# EAGLE design Thruster-Commander-Programmer (EAGLE 8.4.3)
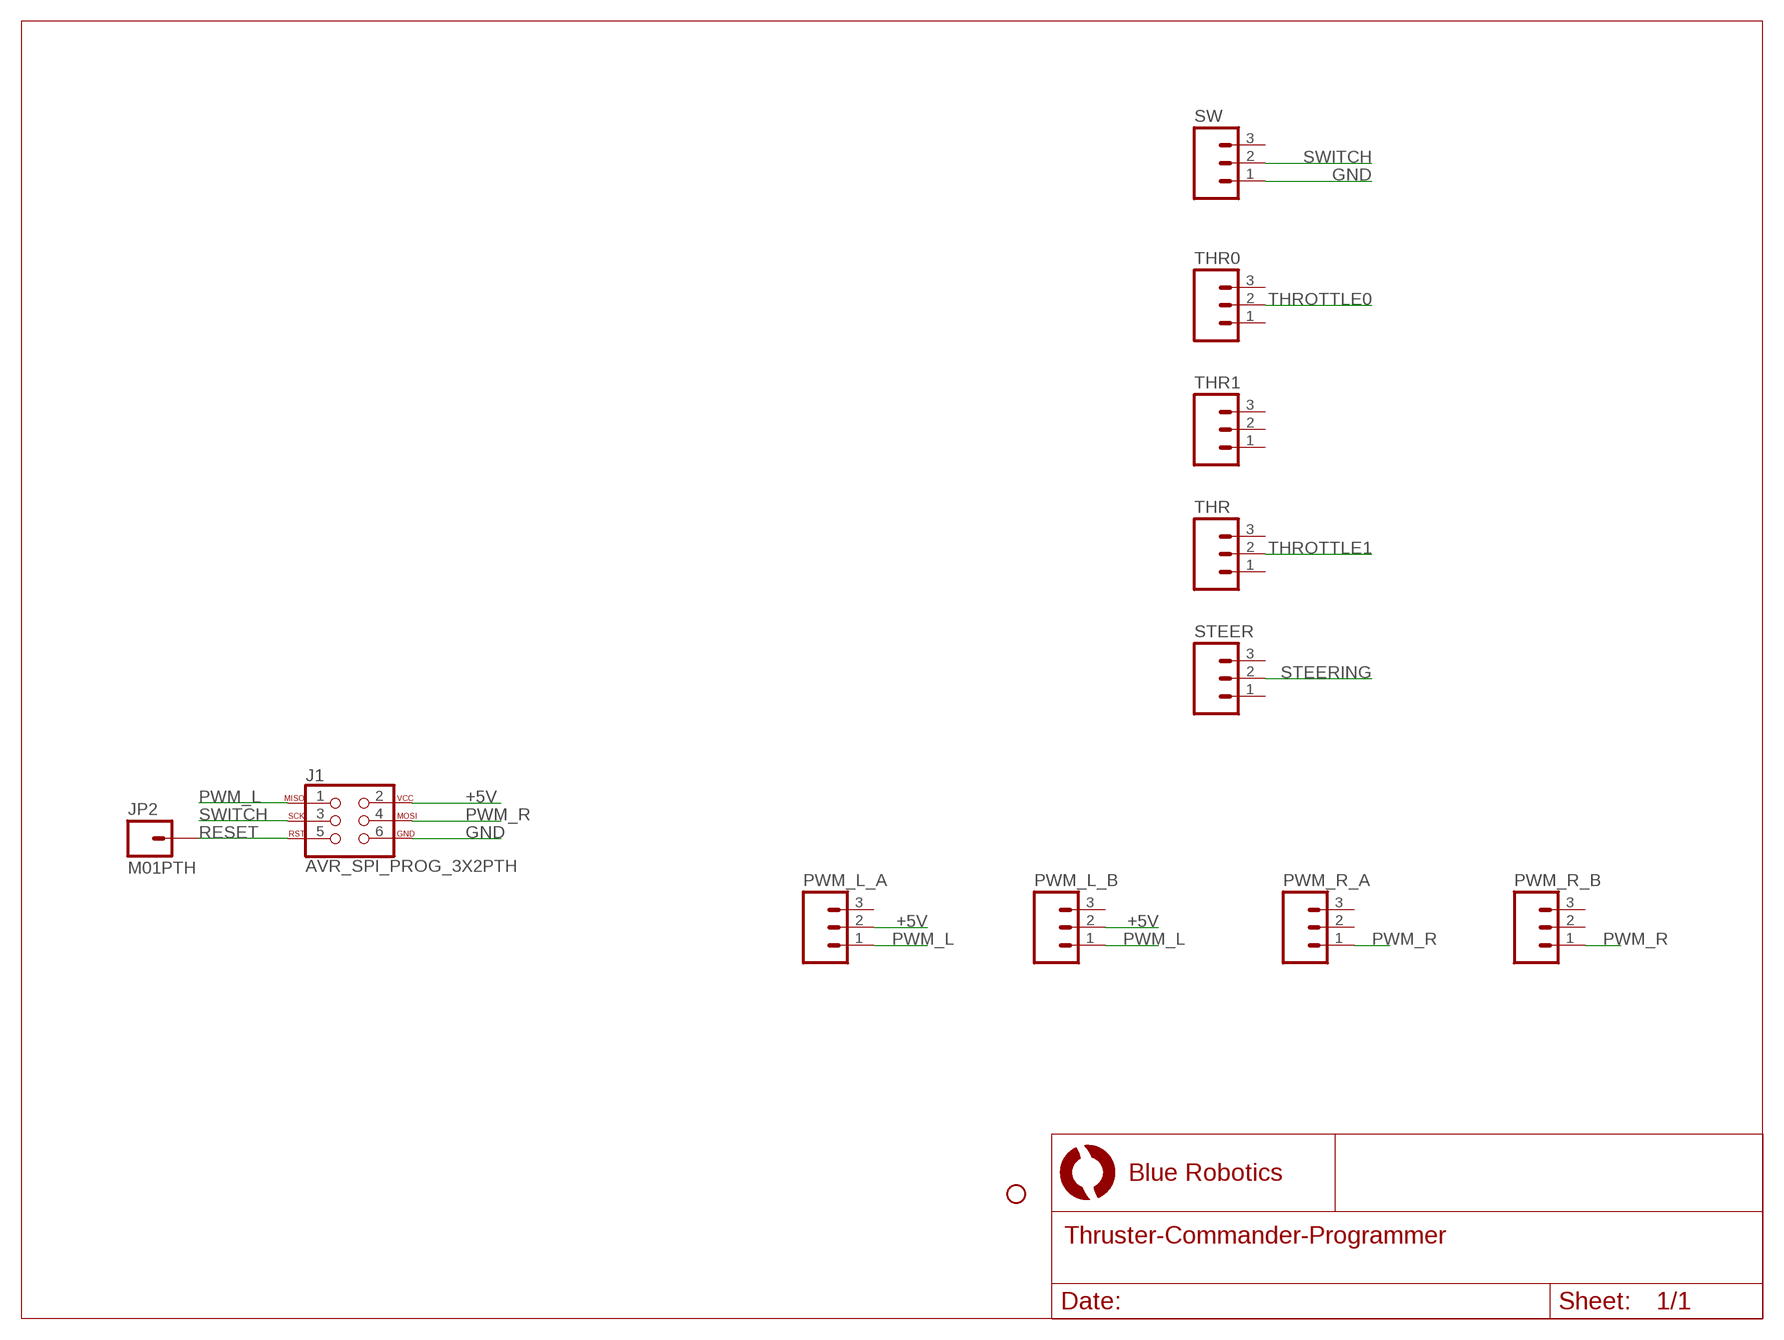
[diagram p0: schematic, sheet 1]

## Parts
J1  AVR_SPI_PROG_3X2PTH  [2X3]
JP2  M01PTH  [1X01]
PWM_L_A  M03PTH  [1X03]
PWM_L_B  M03PTH  [1X03]
PWM_R_A  M03PTH  [1X03]
PWM_R_B  M03PTH  [1X03]
STANDOFF1  STAND-OFF  [STAND-OFF]
STEER  M03PTH  [1X03]
SW  M03PTH  [1X03]
THR  M03PTH  [1X03]
THR0  M03PTH  [1X03]
THR1  M03PTH  [1X03]

## Nets
+5V: J1.2 PWM_L_A.2 PWM_L_B.2
GND: J1.6 SW.1
PWM_L: J1.1 PWM_L_A.1 PWM_L_B.1
PWM_R: J1.4 PWM_R_A.1 PWM_R_B.1
RESET: J1.5 JP2.1
STEERING: STEER.2
SWITCH: J1.3 SW.2
THROTTLE0: THR0.2
THROTTLE1: THR.2
Unconnected: PWM_L_A.3 PWM_L_B.3 PWM_R_A.2 PWM_R_A.3 PWM_R_B.2 PWM_R_B.3 STEER.1 STEER.3 SW.3 THR0.1 THR0.3 THR1.1 THR1.2 THR1.3 THR.1 THR.3

## Library data of the parts
J1 = SparkFun-Connectors:AVR_SPI_PROG_3X2: AVR ISP 6 Pin This is the reduced ISP connector for AVR programming. Common on Arduino. This footprint will take up less PCB space and can be used with a 10-pin to 6-pin adapter such as SKU: BOB-08508 **Special note about "TEST_POINT" package. The stop mask is on the top side, so if you want your programming test points to be on the bottom of your board, make sure to place this package on the bottom side of the board. This also ensure that the orientation to program from the bottom side will be correct. SparkFun Products: SparkFun ISP Pogo Adapter <https://www.sparkfun.com/products/11591> - NS Tiny AVR Programmer <https://www.sparkfun.com/products/11801> -PTH
JP2 = SparkFun-Connectors:M01: Header 1 Standard 1-pin 0.1" header. Use with straight break away headers (SKU : PRT-00116), right angle break away headers (PRT-00553), swiss pins (PRT-00743), machine pins (PRT-00117), and female headers (PRT-00115).
PWM_L_A PWM_L_B PWM_R_A PWM_R_B STEER SW THR THR0 THR1 = SparkFun-Connectors:M03: Header 3 Standard 3-pin 0.1" header. Use with straight break away headers (SKU : PRT-00116), right angle break away headers (PRT-00553), swiss pins (PRT-00743), machine pins (PRT-00117), and female headers (PRT-00115). Molex polarized connector foot print use with SKU : PRT-08232 with associated crimp pins and housings.
STANDOFF1 = SparkFun-Electromechanical:STAND-OFF: #4 Stand Off This is the mechanical footprint for a #4 phillips button head screw. Use the keepout ring to avoid running the screw head into surrounding components. SKU : PRT-00447

## Board
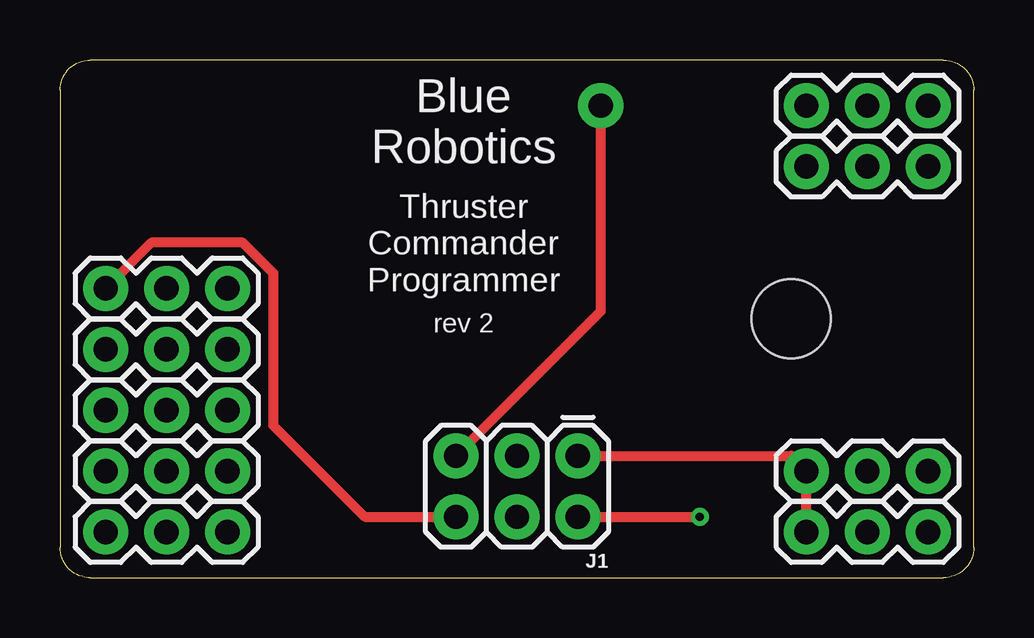
[diagram p1: board, top side]
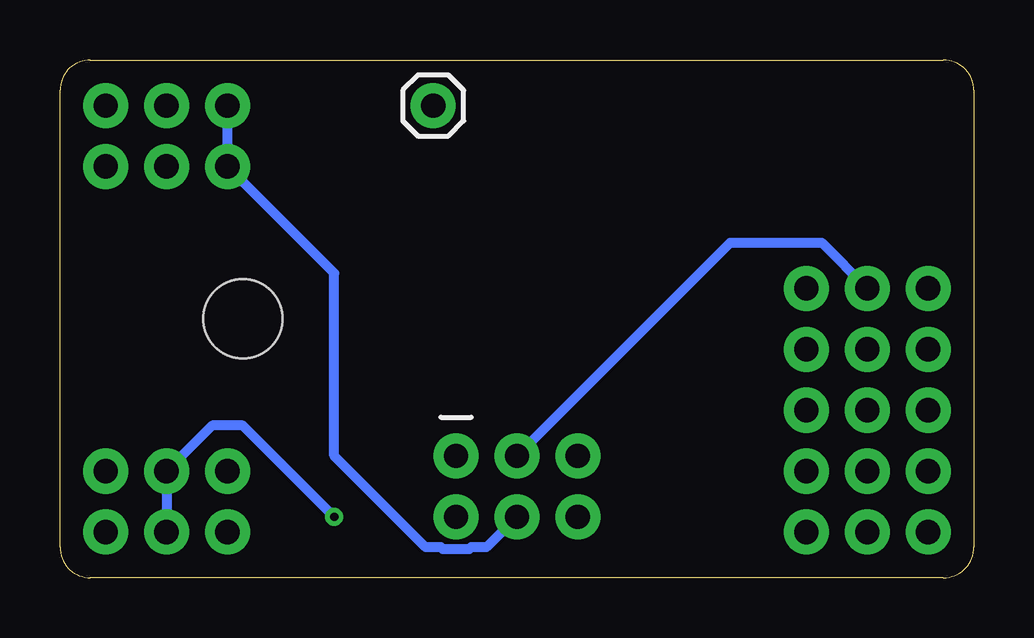
[diagram p2: board, bottom side, seen from below]

Size 38.1 x 21.59 mm. Coordinates in mm from the lower left corner, seen from the top.
Outline: 1.27,0 36.83,0 arc90 38.1,1.27 38.1,20.32 arc90 36.83,21.59 1.27,21.59 arc90 0,20.32 0,1.27 arc90 1.27,0
Copper layers (1*16): Top 0.035mm / dielectric 1.5mm / Bottom 0.035mm
Design rules "default *": minimum track width 10mil, minimum drill 13mil, track to track 8mil, track to pad 8mil, pad to pad 8mil, via to via 8mil, smd to smd 8mil, copper to edge 20mil, drill to drill 8mil, minimum pad ring 10mil, minimum via ring 8mil, stop-mask expansion 4mil, vias tented up to drill 30mil, thermal gap 10mil

### Footprints (pad centres in the part's own frame; a part is rotated, then mirrored left to right if it is on the bottom)
2X3 = drill 1.016 pad 1.88: 1 0,0; 2 0,2.54; 3 2.54,0; 4 2.54,2.54; 5 5.08,0; 6 5.08,2.54
1X01 = drill 1.016 pad 1.88: 1 0,0
1X03 = drill 1.016 pad 1.88: 1 0,0; 2 2.54,0; 3 5.08,0
STAND-OFF = hole 3.302: 0,0

### Placement (x,y rotation side)
J1  21.59,5.08 180 top
JP2  22.54,19.68 0 bottom
PWM_L_A  31.11,4.45 0 top
PWM_L_B  31.11,1.91 0 top
PWM_R_A  31.11,17.14 0 top
PWM_R_B  31.11,19.68 0 top
STANDOFF1  30.48,10.79 0 top
STEER  1.91,1.91 0 top
SW  1.91,12.06 0 top
THR  1.91,4.45 0 top
THR0  1.91,9.53 0 top
THR1  1.91,6.99 0 top

### Tracks (layer width: path | path; a pad name or v marks a point on that pad's centre or on a via)
+5V  (via drill 0.35)
  Top 0.406: J1.2 v26.67,2.54
  Bottom 0.406: v26.67,2.54 30.48,6.35 31.75,6.35 PWM_L_A.2 PWM_L_B.2
GND
  Top 0.406: SW.1 3.81,13.97 7.62,13.97 8.89,12.7 8.89,6.35 12.7,2.54 J1.6
PWM_L
  Top 0.406: J1.1 30.48,5.08 PWM_L_A.1 PWM_L_B.1
PWM_R
  Bottom 0.406: PWM_R_B.1 PWM_R_A.1 26.67,12.7 26.67,5.08 22.86,1.27 22.22,1.27 22.15,1.19 21.03,1.19 20.96,1.27 20.32,1.27 J1.4
RESET
  Top 0.406: J1.5 22.54,11.11 JP2.1
SWITCH
  Bottom 0.406: J1.3 10.16,13.97 6.35,13.97 SW.2

### Text on the board
tPlace: Blue / Robotics | Thruster / Commander / Programmer | rev 2